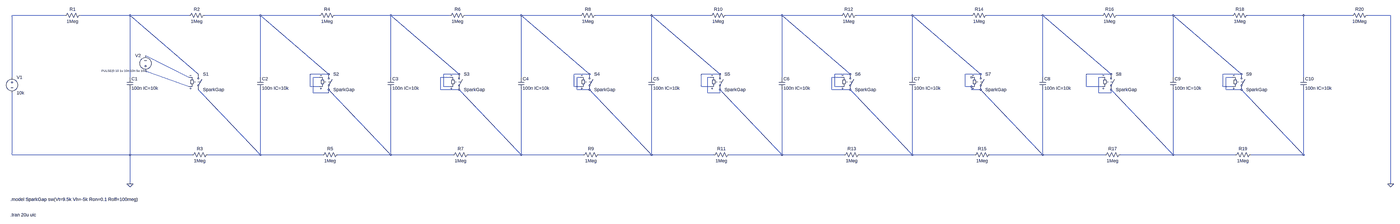
[diagram p0: schematic Marx_generator.asc, whole sheet]
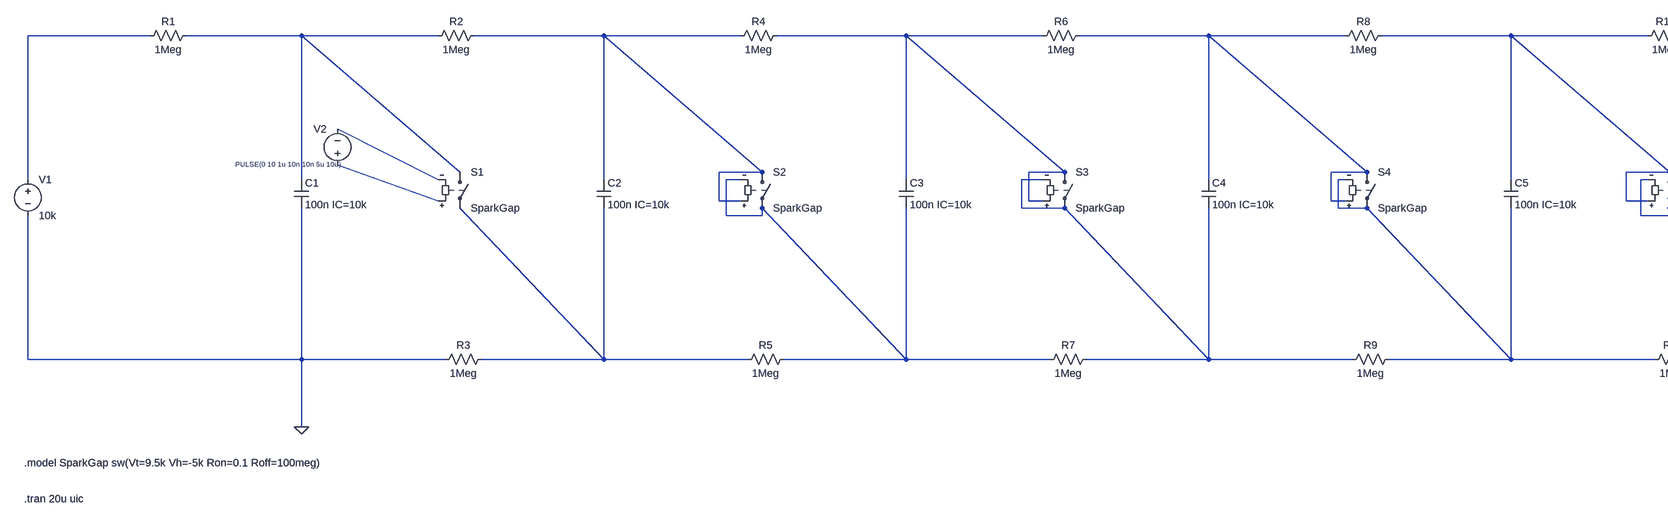
[diagram p1: schematic Marx_generator.asc, part, row 1 of 1, column 1 of 2]
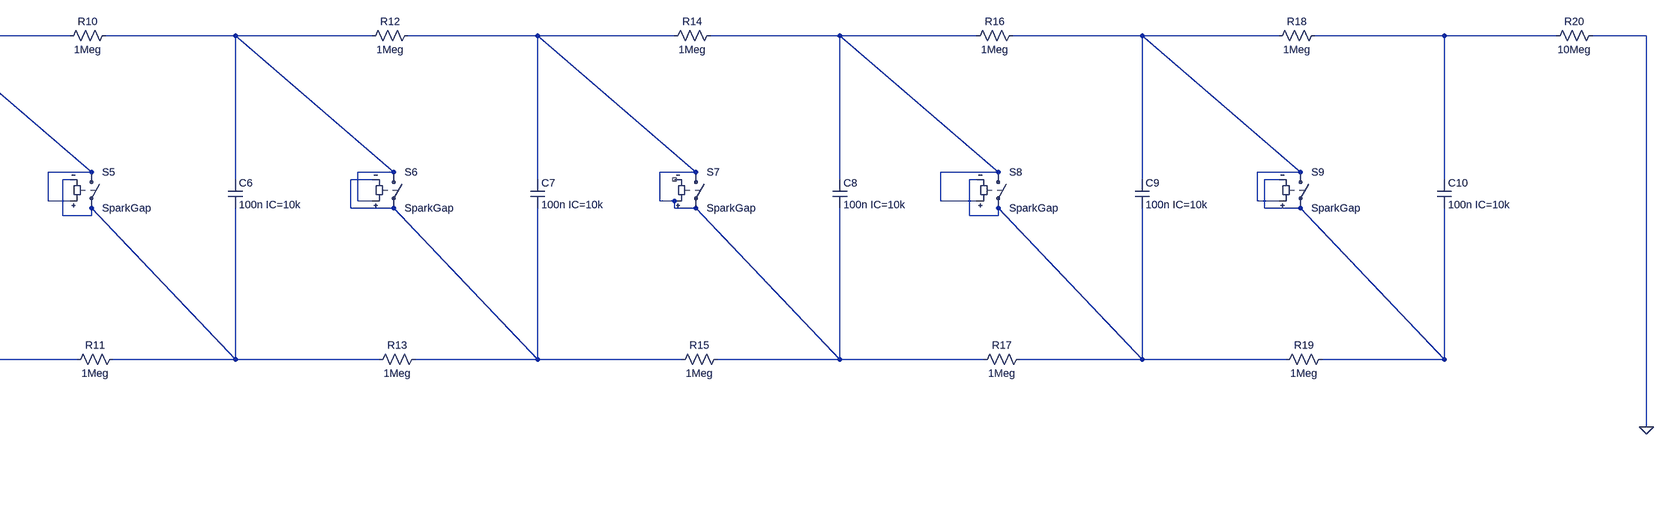
[diagram p2: schematic Marx_generator.asc, part, row 1 of 1, column 2 of 2]
Marx_generator.asc, the LTspice schematic file:
Version 4.1
SHEET 1 6804 1124
WIRE -528 16 -800 16
WIRE -192 16 -448 16
WIRE 112 16 -192 16
WIRE 480 16 192 16
WIRE 784 16 480 16
WIRE 1152 16 864 16
WIRE 1456 16 1152 16
WIRE 1824 16 1536 16
WIRE 2128 16 1824 16
WIRE 2496 16 2208 16
WIRE 2800 16 2496 16
WIRE 3168 16 2880 16
WIRE 3472 16 3168 16
WIRE 3840 16 3552 16
WIRE 4144 16 3840 16
WIRE 4512 16 4224 16
WIRE 4816 16 4512 16
WIRE 5184 16 4896 16
WIRE 5488 16 5184 16
WIRE 5856 16 5568 16
WIRE 6160 16 5856 16
WIRE 6480 16 6240 16
WIRE 160 320 -192 16
WIRE 832 320 480 16
WIRE 832 320 736 320
WIRE 1504 320 1152 16
WIRE 1504 320 1424 320
WIRE 2176 320 1824 16
WIRE 2176 320 2096 320
WIRE 2848 320 2496 16
WIRE 2848 320 2752 320
WIRE 3520 320 3168 16
WIRE 3520 320 3440 320
WIRE 4192 320 3840 16
WIRE 4192 320 4112 320
WIRE 4864 320 4512 16
WIRE 4864 320 4736 320
WIRE 5536 320 5184 16
WIRE 5536 320 5440 320
WIRE -800 336 -800 16
WIRE -192 336 -192 16
WIRE 112 336 -112 224
WIRE 480 336 480 16
WIRE 784 336 752 336
WIRE 1152 336 1152 16
WIRE 1456 336 1408 336
WIRE 1824 336 1824 16
WIRE 2128 336 2112 336
WIRE 2496 336 2496 16
WIRE 2800 336 2784 336
WIRE 3168 336 3168 16
WIRE 3472 336 3424 336
WIRE 3840 336 3840 16
WIRE 4512 336 4512 16
WIRE 4816 336 4800 336
WIRE 5184 336 5184 16
WIRE 5488 336 5456 336
WIRE 5856 336 5856 16
WIRE 112 384 -112 304
WIRE 736 384 736 320
WIRE 784 384 736 384
WIRE 1424 384 1424 320
WIRE 1456 384 1424 384
WIRE 2096 384 2096 320
WIRE 2128 384 2096 384
WIRE 2752 384 2752 320
WIRE 2800 384 2752 384
WIRE 3440 384 3440 320
WIRE 3472 384 3440 384
WIRE 4112 384 4112 320
WIRE 4144 384 4112 384
WIRE 4736 384 4736 320
WIRE 4816 384 4736 384
WIRE 5440 384 5440 320
WIRE 5488 384 5440 384
WIRE 1408 400 1408 336
WIRE 1504 400 1408 400
WIRE 2112 400 2112 336
WIRE 2176 400 2112 400
WIRE 2848 400 2848 384
WIRE 3424 400 3424 336
WIRE 3520 400 3424 400
WIRE 4144 400 4144 384
WIRE 4192 400 4144 400
WIRE 5456 400 5456 336
WIRE 5536 400 5456 400
WIRE 752 416 752 336
WIRE 832 416 832 400
WIRE 832 416 752 416
WIRE 2784 416 2784 336
WIRE 2848 416 2848 400
WIRE 2848 416 2784 416
WIRE 4800 416 4800 336
WIRE 4864 416 4864 400
WIRE 4864 416 4800 416
WIRE -800 736 -800 416
WIRE -192 736 -192 400
WIRE -192 736 -800 736
WIRE 128 736 -192 736
WIRE 480 736 160 400
WIRE 480 736 480 400
WIRE 480 736 208 736
WIRE 800 736 480 736
WIRE 1152 736 832 400
WIRE 1152 736 1152 400
WIRE 1152 736 880 736
WIRE 1472 736 1152 736
WIRE 1824 736 1504 400
WIRE 1824 736 1824 400
WIRE 1824 736 1552 736
WIRE 2144 736 1824 736
WIRE 2496 736 2176 400
WIRE 2496 736 2496 400
WIRE 2496 736 2224 736
WIRE 2816 736 2496 736
WIRE 3168 736 2848 400
WIRE 3168 736 3168 400
WIRE 3168 736 2896 736
WIRE 3488 736 3168 736
WIRE 3840 736 3520 400
WIRE 3840 736 3840 400
WIRE 3840 736 3568 736
WIRE 4160 736 3840 736
WIRE 4512 736 4192 400
WIRE 4512 736 4512 400
WIRE 4512 736 4240 736
WIRE 4832 736 4512 736
WIRE 5184 736 4864 400
WIRE 5184 736 5184 400
WIRE 5184 736 4912 736
WIRE 5504 736 5184 736
WIRE 5856 736 5536 400
WIRE 5856 736 5856 400
WIRE 5856 736 5584 736
WIRE -192 896 -192 736
WIRE 6480 896 6480 16
FLAG 6480 896 0
FLAG -192 896 0
SYMBOL voltage -800 320 R0
SYMATTR InstName V1
SYMATTR Value 10k
SYMBOL res -432 0 R90
WINDOW 0 0 56 VBottom 2
WINDOW 3 32 56 VTop 2
SYMATTR InstName R1
SYMATTR Value 1Meg
SYMBOL cap -208 336 R0
SYMATTR InstName C1
SYMATTR Value 100n IC=10k
SYMBOL res 208 0 R90
WINDOW 0 0 56 VBottom 2
WINDOW 3 32 56 VTop 2
SYMATTR InstName R2
SYMATTR Value 1Meg
SYMBOL res 224 720 R90
WINDOW 0 0 56 VBottom 2
WINDOW 3 32 56 VTop 2
SYMATTR InstName R3
SYMATTR Value 1Meg
SYMBOL sw 160 304 R0
SYMATTR InstName S1
SYMATTR Value SparkGap
SYMBOL cap 464 336 R0
SYMATTR InstName C2
SYMATTR Value 100n IC=10k
SYMBOL res 880 0 R90
WINDOW 0 0 56 VBottom 2
WINDOW 3 32 56 VTop 2
SYMATTR InstName R4
SYMATTR Value 1Meg
SYMBOL res 896 720 R90
WINDOW 0 0 56 VBottom 2
WINDOW 3 32 56 VTop 2
SYMATTR InstName R5
SYMATTR Value 1Meg
SYMBOL sw 832 304 R0
SYMATTR InstName S2
SYMATTR Value SparkGap
SYMBOL cap 1136 336 R0
SYMATTR InstName C3
SYMATTR Value 100n IC=10k
SYMBOL res 1552 0 R90
WINDOW 0 0 56 VBottom 2
WINDOW 3 32 56 VTop 2
SYMATTR InstName R6
SYMATTR Value 1Meg
SYMBOL res 1568 720 R90
WINDOW 0 0 56 VBottom 2
WINDOW 3 32 56 VTop 2
SYMATTR InstName R7
SYMATTR Value 1Meg
SYMBOL sw 1504 304 R0
SYMATTR InstName S3
SYMATTR Value SparkGap
SYMBOL cap 1808 336 R0
SYMATTR InstName C4
SYMATTR Value 100n IC=10k
SYMBOL res 2224 0 R90
WINDOW 0 0 56 VBottom 2
WINDOW 3 32 56 VTop 2
SYMATTR InstName R8
SYMATTR Value 1Meg
SYMBOL res 2240 720 R90
WINDOW 0 0 56 VBottom 2
WINDOW 3 32 56 VTop 2
SYMATTR InstName R9
SYMATTR Value 1Meg
SYMBOL sw 2176 304 R0
SYMATTR InstName S4
SYMATTR Value SparkGap
SYMBOL cap 2480 336 R0
SYMATTR InstName C5
SYMATTR Value 100n IC=10k
SYMBOL res 2896 0 R90
WINDOW 0 0 56 VBottom 2
WINDOW 3 32 56 VTop 2
SYMATTR InstName R10
SYMATTR Value 1Meg
SYMBOL res 2912 720 R90
WINDOW 0 0 56 VBottom 2
WINDOW 3 32 56 VTop 2
SYMATTR InstName R11
SYMATTR Value 1Meg
SYMBOL sw 2848 304 R0
SYMATTR InstName S5
SYMATTR Value SparkGap
SYMBOL cap 3152 336 R0
SYMATTR InstName C6
SYMATTR Value 100n IC=10k
SYMBOL res 3568 0 R90
WINDOW 0 0 56 VBottom 2
WINDOW 3 32 56 VTop 2
SYMATTR InstName R12
SYMATTR Value 1Meg
SYMBOL res 3584 720 R90
WINDOW 0 0 56 VBottom 2
WINDOW 3 32 56 VTop 2
SYMATTR InstName R13
SYMATTR Value 1Meg
SYMBOL sw 3520 304 R0
SYMATTR InstName S6
SYMATTR Value SparkGap
SYMBOL cap 3824 336 R0
SYMATTR InstName C7
SYMATTR Value 100n IC=10k
SYMBOL res 4240 0 R90
WINDOW 0 0 56 VBottom 2
WINDOW 3 32 56 VTop 2
SYMATTR InstName R14
SYMATTR Value 1Meg
SYMBOL res 4256 720 R90
WINDOW 0 0 56 VBottom 2
WINDOW 3 32 56 VTop 2
SYMATTR InstName R15
SYMATTR Value 1Meg
SYMBOL sw 4192 304 R0
SYMATTR InstName S7
SYMATTR Value SparkGap
SYMBOL cap 4496 336 R0
SYMATTR InstName C8
SYMATTR Value 100n IC=10k
SYMBOL res 4912 0 R90
WINDOW 0 0 56 VBottom 2
WINDOW 3 32 56 VTop 2
SYMATTR InstName R16
SYMATTR Value 1Meg
SYMBOL res 4928 720 R90
WINDOW 0 0 56 VBottom 2
WINDOW 3 32 56 VTop 2
SYMATTR InstName R17
SYMATTR Value 1Meg
SYMBOL sw 4864 304 R0
SYMATTR InstName S8
SYMATTR Value SparkGap
SYMBOL cap 5168 336 R0
SYMATTR InstName C9
SYMATTR Value 100n IC=10k
SYMBOL res 5584 0 R90
WINDOW 0 0 56 VBottom 2
WINDOW 3 32 56 VTop 2
SYMATTR InstName R18
SYMATTR Value 1Meg
SYMBOL res 5600 720 R90
WINDOW 0 0 56 VBottom 2
WINDOW 3 32 56 VTop 2
SYMATTR InstName R19
SYMATTR Value 1Meg
SYMBOL sw 5536 304 R0
SYMATTR InstName S9
SYMATTR Value SparkGap
SYMBOL cap 5840 336 R0
SYMATTR InstName C10
SYMATTR Value 100n IC=10k
SYMBOL res 6256 0 R90
WINDOW 0 0 56 VBottom 2
WINDOW 3 32 56 VTop 2
SYMATTR InstName R20
SYMATTR Value 10Meg
SYMBOL voltage -112 320 R180
WINDOW 0 24 96 Left 2
WINDOW 3 110 7 Top 1
WINDOW 123 0 0 Left 0
WINDOW 39 0 0 Left 0
SYMATTR InstName V2
SYMATTR Value PULSE(0 10 1u 10n 10n 5u 10u)
TEXT -808 976 Left 2 !.model SparkGap sw(Vt=9.5k Vh=-5k Ron=0.1 Roff=100meg)
TEXT -808 1056 Left 2 !.tran 20u uic

The netlist it stands for:
* Marx_generator.asc
V1 N001 0 10k
R1 N002 N001 1Meg
C1 N002 0 100n IC=10k
R2 N003 N002 1Meg
R3 N021 0 1Meg
S1 N002 N021 N020 N012 SparkGap
C2 N003 N021 100n IC=10k
R4 N004 N003 1Meg
R5 N013 N021 1Meg
S2 N003 N013 N003 N013 SparkGap
C3 N004 N013 100n IC=10k
R6 N005 N004 1Meg
R7 N014 N013 1Meg
S3 N004 N014 N004 N014 SparkGap
C4 N005 N014 100n IC=10k
R8 N006 N005 1Meg
R9 N015 N014 1Meg
S4 N005 N015 N005 N015 SparkGap
C5 N006 N015 100n IC=10k
R10 N007 N006 1Meg
R11 N016 N015 1Meg
S5 N006 N016 N006 N016 SparkGap
C6 N007 N016 100n IC=10k
R12 N008 N007 1Meg
R13 N017 N016 1Meg
S6 N007 N017 N007 N017 SparkGap
C7 N008 N017 100n IC=10k
R14 N009 N008 1Meg
R15 N008 N017 1Meg
S7 N008 N008 N008 NC_01 SparkGap
C8 N009 N008 100n IC=10k
R16 N010 N009 1Meg
R17 N018 N008 1Meg
S8 N009 N018 N009 N018 SparkGap
C9 N010 N018 100n IC=10k
R18 N011 N010 1Meg
R19 N019 N018 1Meg
S9 N010 N019 N010 N019 SparkGap
C10 N011 N019 100n IC=10k
R20 0 N011 10Meg
V2 N020 N012 PULSE(0 10 1u 10n 10n 5u 10u)
.model SparkGap sw(Vt=9.5k Vh=-5k Ron=0.1 Roff=100meg)
.tran 20u uic
.backanno
.end